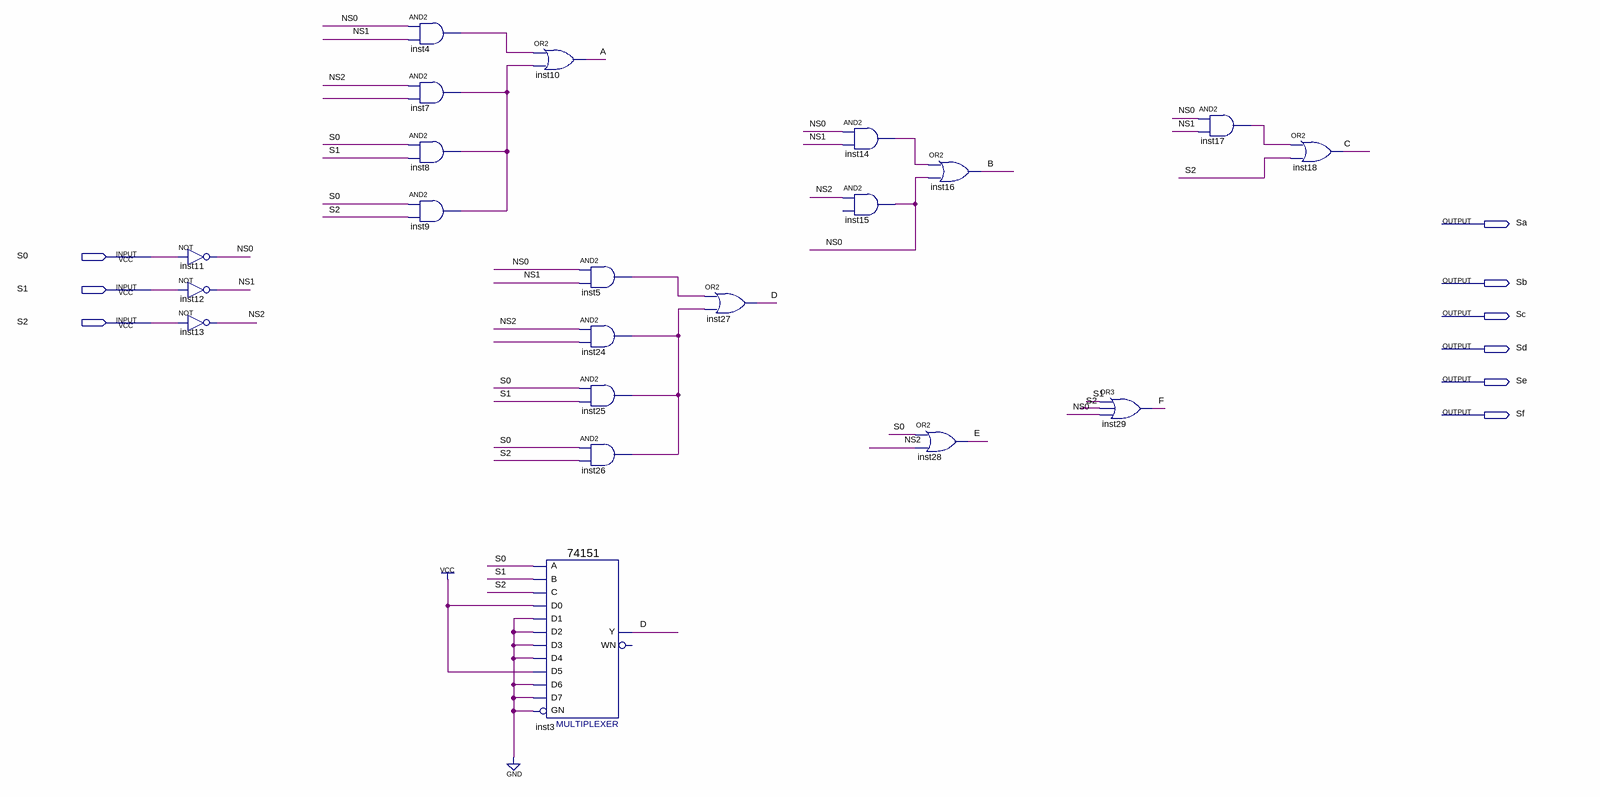
[diagram p0: schematic sheet]
// Quartus schematic Projeto.bdf as structural Verilog: 21 symbols, 9 pins
module Projeto (
  input  S0,
  input  S1,
  input  S2,
  output Sa,
  output Sb,
  output Sc,
  output Sd,
  output Se,
  output Sf
);

  wire A, B, C, D, E, F, inst4_out, inst5_out, inst7_out, inst14_out, inst17_out, inst24_out, NS0, NS1, NS2,
       undriven, undriven_2;

  not inst11 (NS0, S0);
  not inst12 (NS1, S1);
  not inst13 (NS2, S2);
  and inst4 (inst4_out, NS0, NS1);
  and inst7 (inst7_out, NS2, undriven);
  and inst8 (inst7_out, S0, S1);
  and inst9 (inst7_out, S0, S2);
  or inst10 (A, inst4_out, inst7_out);
  \74151  inst3 (
    .GN(1'b0), .C(S2), .B(S1), .A(S0), .D5(1'b1), .D0(1'b1), .D1(1'b0), .D4(1'b0), .D3(1'b0), .D2(1'b0),
    .D6(1'b0), .D7(1'b0), .Y(D));  // open: WN
  and inst5 (inst5_out, NS0, NS1);
  and inst24 (inst24_out, NS2, undriven_2);
  and inst25 (inst24_out, S0, S1);
  and inst26 (inst24_out, S0, S2);
  or inst27 (D, inst5_out, inst24_out);
  and inst14 (inst14_out, NS0, NS1);
  buf inst15 (NS0, NS2);  // AND2 open: IN2
  or inst16 (B, inst14_out, NS0);
  or inst28 (E, S0, NS2);
  or inst29 (F, S1, S2, NS0);
  and inst17 (inst17_out, NS0, NS1);
  or inst18 (C, inst17_out, S2);
endmodule
